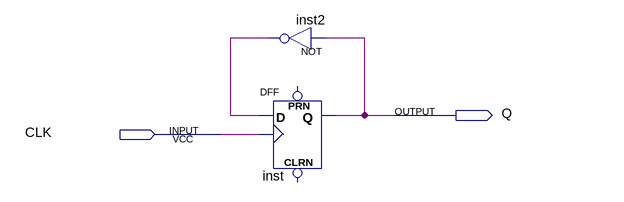
[diagram p0: schematic sheet]
// Quartus schematic dutymetade.bdf as structural Verilog: 2 symbols, 2 pins
module dutymetade (
  input  CLK,
  output Q
);

  wire inst2_out;

  not inst2 (inst2_out, Q);
  DFF inst (.CLK(CLK), .D(inst2_out), .Q(Q));  // open: CLRN, PRN
endmodule
